# Altium schematic sheet MicPreamp.SchDoc
size A
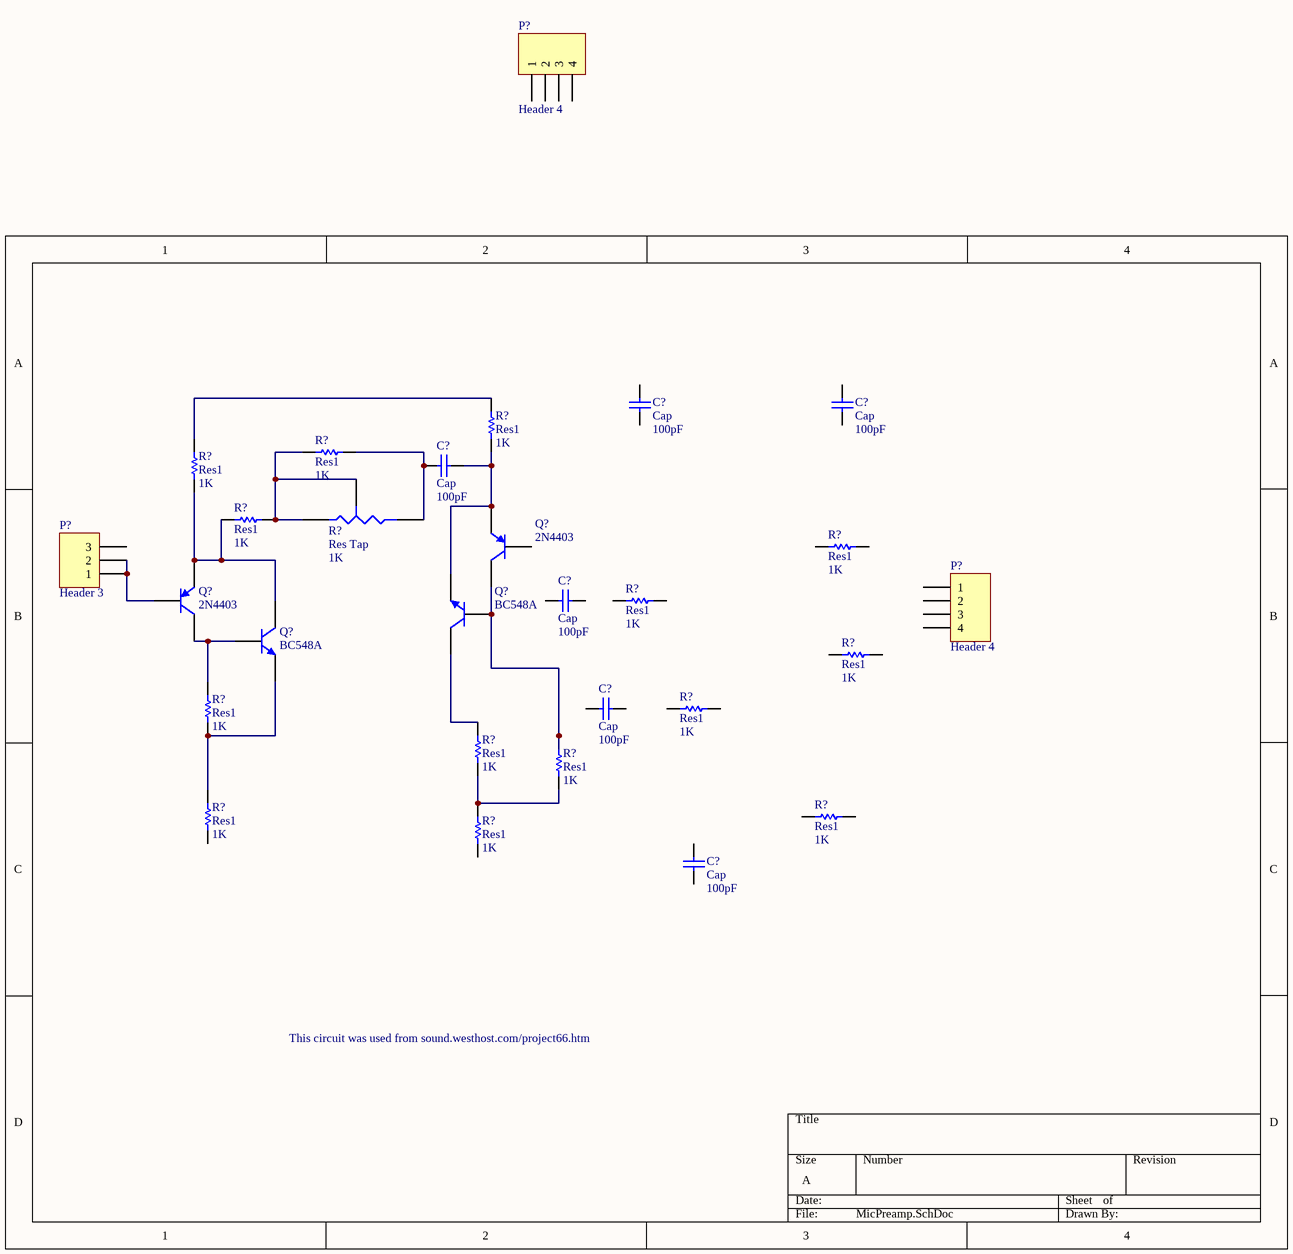
[diagram p0: MicPreamp.SchDoc]

## Parts
(Parts that share a designator on the sheet are numbered #1, #2 ... from top to bottom, then left to right.)
C?#1  Cap  value 100pF  [RAD-0.3]
C?#2  Cap  value 100pF  [RAD-0.3]
C?#3  Cap  value 100pF  [RAD-0.3]
C?#4  Cap  value 100pF  [RAD-0.3]
C?#5  Cap  value 100pF  [RAD-0.3]
C?#6  Cap  value 100pF  [RAD-0.3]
P?#1  Header 4  [HDR1X4]
P?#2  Header 4  [HDR1X4]
P?#3  Header 3  [HDR1X3]
Q?#1  2N4403  [TO-92A]
Q?#2  2N4403  [TO-92A]
Q?#3  BC548A  [29-04]
Q?#4  BC548A  [29-04]
R?#1  Res1  value 1K  [AXIAL-0.3]
R?#2  Res1  value 1K  [AXIAL-0.3]
R?#3  Res1  value 1K  [AXIAL-0.3]
R?#4  Res1  value 1K  [AXIAL-0.3]
R?#5  Res Tap  value 1K  [VR3]
R?#6  Res1  value 1K  [AXIAL-0.3]
R?#7  Res1  value 1K  [AXIAL-0.3]
R?#8  Res1  value 1K  [AXIAL-0.3]
R?#9  Res1  value 1K  [AXIAL-0.3]
R?#10  Res1  value 1K  [AXIAL-0.3]
R?#11  Res1  value 1K  [AXIAL-0.3]
R?#12  Res1  value 1K  [AXIAL-0.3]
R?#13  Res1  value 1K  [AXIAL-0.3]
R?#14  Res1  value 1K  [AXIAL-0.3]
R?#15  Res1  value 1K  [AXIAL-0.3]

## Nets
NetC?#3_1: C?#3.1 R?#1.2 R?#5.2(B)
NetC?#3_2: C?#3.2 Q?#1.1(E) Q?#4.3(E) R?#2.1
NetP?#3_1: P?#3.1 P?#3.2 Q?#2.2(B)
NetQ?#1_3: Q?#1.3(C) Q?#4.2(B) R?#12.1
NetQ?#2_1: Q?#2.1(E) Q?#3.1(C) R?#3.1 R?#4.1
NetQ?#2_3: Q?#2.3(C) Q?#3.2(B) R?#9.1
NetQ?#3_3: Q?#3.3(E) R?#9.2 R?#13.1
NetQ?#4_1: Q?#4.1(C) R?#11.1
NetR?#1_1: R?#1.1 R?#4.2 R?#5.1(A) R?#5.3(TAP)
NetR?#2_2: R?#2.2 R?#3.2
NetR?#11_2: R?#11.2 R?#12.2 R?#15.1

Not connected (* = marked no-connect by the designer): C?#1 1 2; C?#2 1 2; C?#4 1 2; C?#5 1 2; C?#6 1 2; P?#1 1 2 3 4; P?#2 1 2 3 4; P?#3 3; Q?#1 2(B); R?#6 1 2; R?#7 1 2; R?#8 1 2; R?#10 1 2; R?#13 2; R?#14 1 2; R?#15 2

## Notes on the sheet
- This circuit was used from sound.westhost.com/project66.htm

## Library data of the parts
C?#1-C?#6 = Cap: Capacitor; Published: 8-Jun-2000; LatestRevisionDate: 17-Jul-2002; LatestRevisionNote: Re-released for DXP Platform.; PackageReference: RAD-0.3; Publisher: Altium Limited; PackageDescription: Radial Cap, Thru-Hole; 2 Leads; 0.3 in Pin Spacing
P?#1 P?#2 = Header 4: Header, 4-Pin; LatestRevisionDate: 17-Jul-2002; LatestRevisionNote: Re-released for DXP Platform.; Publisher: Altium Limited
P?#3 = Header 3: Header, 3-Pin; LatestRevisionDate: 17-Jul-2002; LatestRevisionNote: Re-released for DXP Platform.; Publisher: Altium Limited
Q?#1 Q?#2 = 2N4403: PNP General Purpose Amplifier; Published: 8-Jun-2000; LatestRevisionDate: 17-Jan-2003; LatestRevisionNote: PCB Footprint 'BCY-W3/D4.7' replaced; DatasheetDocument: 1997; PackageDocument: Sep-1998; PackageReference: TO-92A; Publisher: Altium Limited; ComponentLink1Description: Manufacturer Link; ComponentLink1URL: http://www.fairchildsemi.com/; ComponentLink2Description: Datasheet; ComponentLink2URL: http://www.fairchildsemi.com/ds/2N%2F2N4403.pdf
Q?#3 Q?#4 = BC548A: Amplifier Transistor NPN Silicon; Published: 29-Sep-2000; LatestRevisionDate: 17-Jul-2002; LatestRevisionNote: Re-released for DXP Platform.; DatasheetVersion: 1991; PackageVersion: 1996; PackageReference: 29-04; Publisher: Altium Limited; PackageDescription: TO, Flat Index; 3 In-Line, Axial Leads; Body Dia. 4.8mm; Leads 0.48 x 0.5 mm (max); ComponentLink1Description: Manufacturer Link; ComponentLink1URL: http://www.onsemi.com/site/products/landing?taxonomyID=194; ComponentLink2Description: Datasheet; ComponentLink2URL: http://www.onsemi.com/pub/Collateral/BC546-D.PDF
R?#1-R?#4 R?#6-R?#15 = Res1: Resistor; Published: 8-Jun-2000; LatestRevisionDate: 17-Jul-2002; LatestRevisionNote: Re-released for DXP Platform.; PackageReference: AXIAL-0.3; Publisher: Altium Limited; PackageDescription: Axial Device, Thru-Hole; 2 Leads; 0.3 in Pin Spacing
R?#5 = Res Tap: Tapped Resistor; Sim Note: Enter the Resistance value and the set point into parameter fields.; Set Position: 0.5; Published: 24-Mar-1999; LatestRevisionDate: 17-Jul-2002; LatestRevisionNote: Re-released for DXP Platform.; PackageReference: VR3; Publisher: Altium Limited; PackageDescription: Variable Resistor, Thru-Hole; 3 Leads